# EAGLE design source_eagle (EAGLE 9.6.2)
COMPANY: ADAFRUIT INDUSTRIES; DRAWN: KTOWN; REV: B
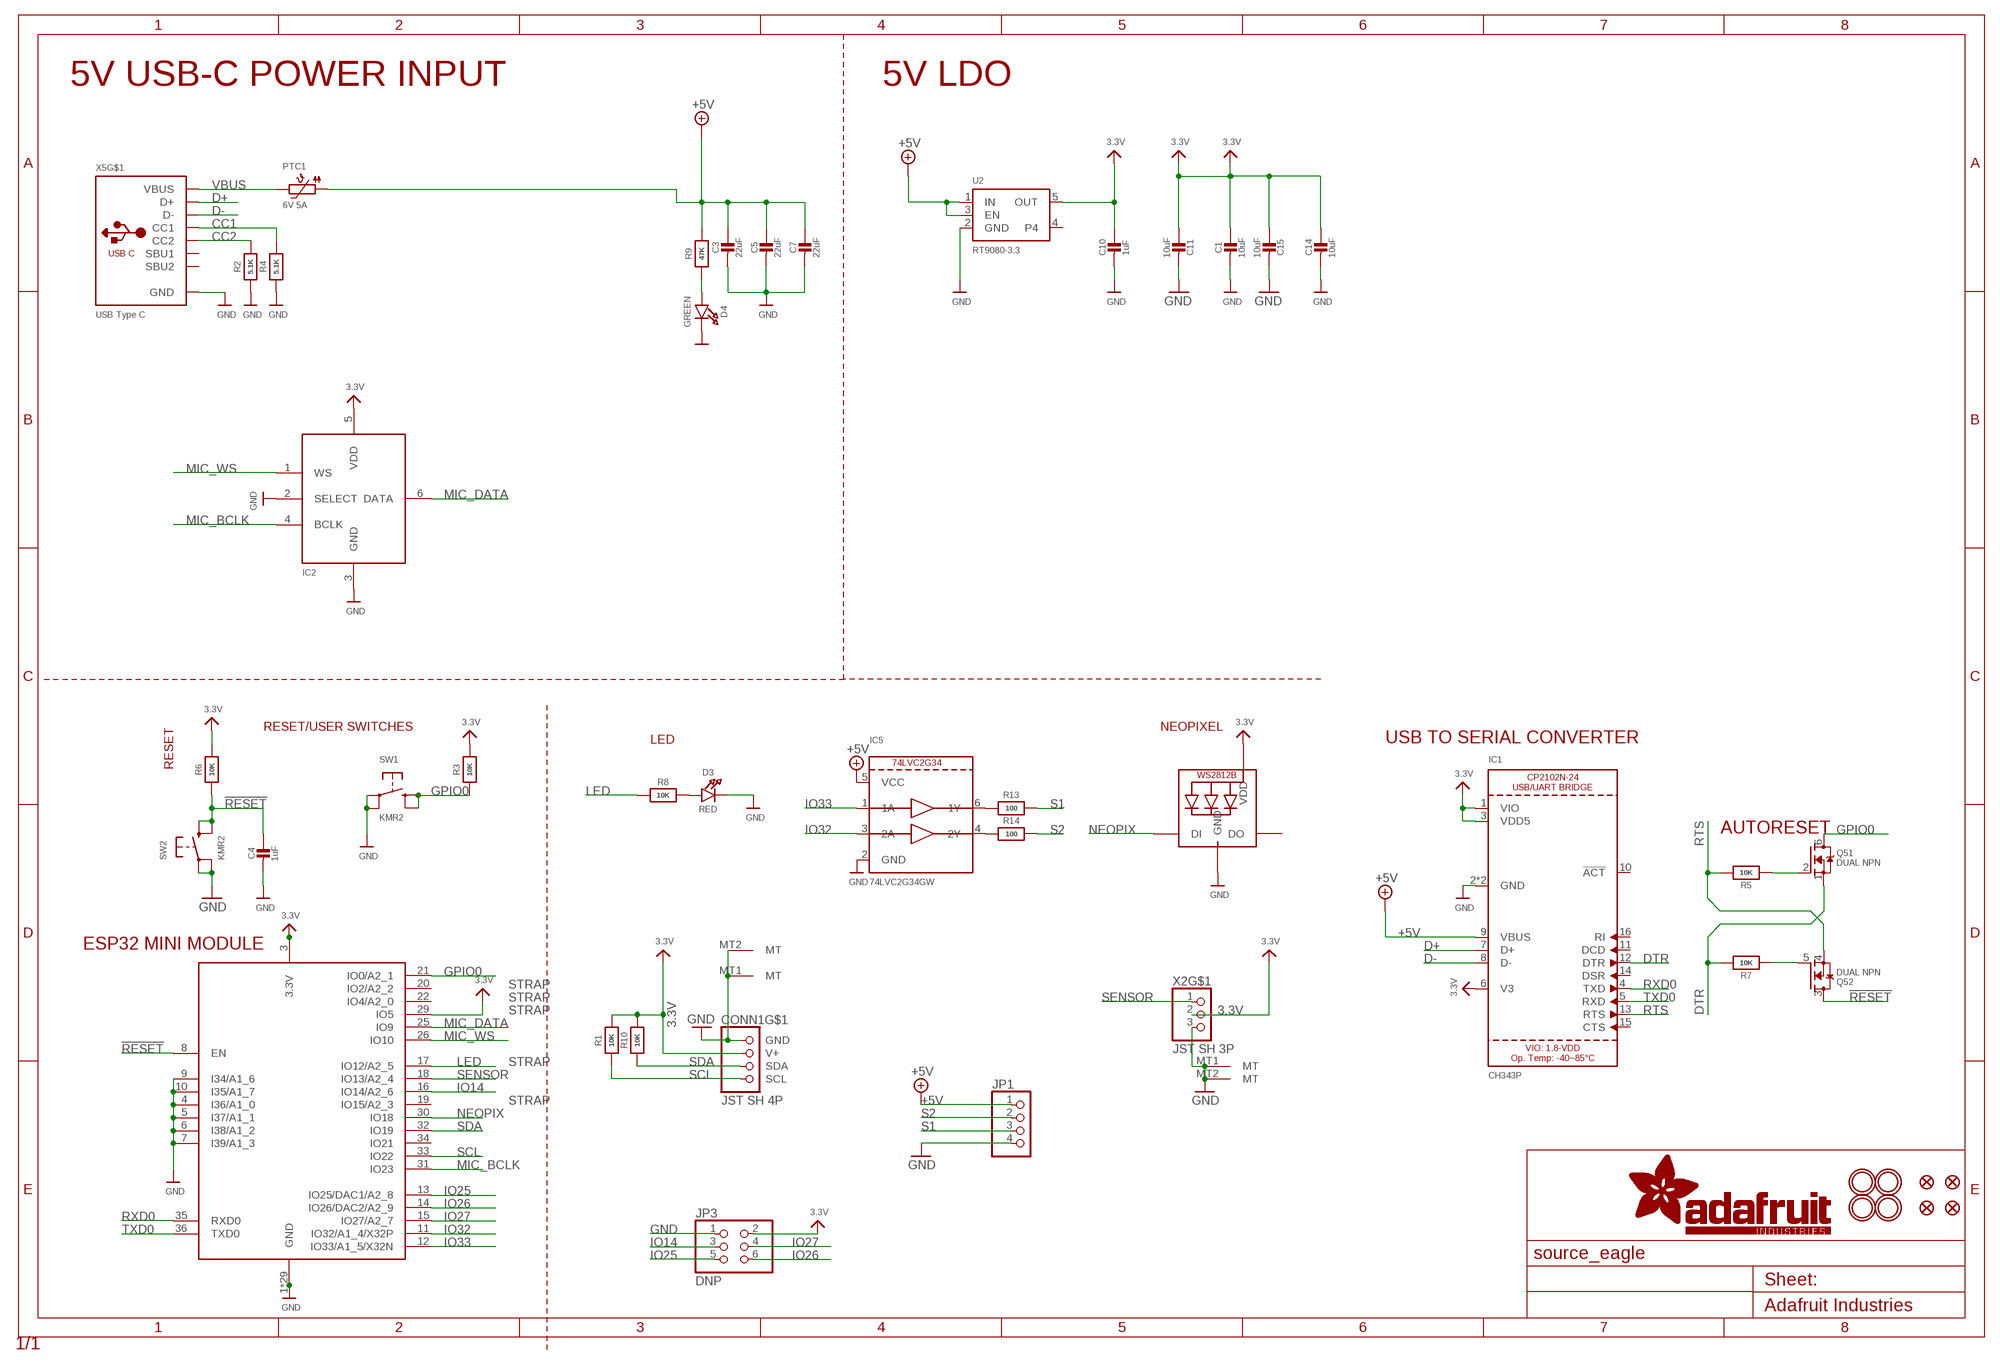
[diagram p0: schematic, sheet 1]

## Parts
C1  10uF  CAP_CERAMIC0805-NOOUTLINE  [0805-NO]
C3  22uF  CAP_CERAMIC0805-NOOUTLINE  [0805-NO]
C4  1uF  CAP_CERAMIC_0402NO  [_0402NO]
C5  22uF  CAP_CERAMIC0805-NOOUTLINE  [0805-NO]
C7  22uF  CAP_CERAMIC0805-NOOUTLINE  [0805-NO]
C10  1uF  CAP_CERAMIC_0402NO  [_0402NO]
C11  10uF  CAP_CERAMIC0805-NOOUTLINE  [0805-NO]
C14  10uF  CAP_CERAMIC0805-NOOUTLINE  [0805-NO]
C15  10uF  CAP_CERAMIC0805-NOOUTLINE  [0805-NO]
CONN1  JST SH 4P  STEMMA_I2C_QT  [JST_SH4]
D3  RED  LED0603_NOOUTLINE  [CHIPLED_0603_NOOUTLINE]
D4  GREEN  LED0603_NOOUTLINE  [CHIPLED_0603_NOOUTLINE]
IC1  CH343P  [QFN16_3MM]
IC2  ICS-43434  MIC_I2S_SPH0645  [SPH0645LM4H]
IC5  74LVC2G34GW  [SC70-6L]
JP1  HEADER-1X4  [1X04_OVAL]
JP3  DNP  HEADER-2X3  [2X03_ROUND_70MIL]
LED1  WS2812B_SK6805_1515  [SK6805_1515]
PTC1  6V 5A  PTC1210  [PTC1210]
Q5  DUAL NPN  MOSFET-N_DUAL  [SOT363]
R1  10K  RESISTOR_0402NO  [_0402NO]
R2  5.1K  RESISTOR_0402NO  [_0402NO]
R3  10K  RESISTOR_0402NO  [_0402NO]
R4  5.1K  RESISTOR_0402NO  [_0402NO]
R5  10K  RESISTOR_0402NO  [_0402NO]
R6  10K  RESISTOR_0402NO  [_0402NO]
R7  10K  RESISTOR_0402NO  [_0402NO]
R8  10K  RESISTOR_0402NO  [_0402NO]
R9  47K  RESISTOR_0402NO  [_0402NO]
R10  10K  RESISTOR_0402NO  [_0402NO]
R13  100  RESISTOR_0402NO  [_0402NO]
R14  100  RESISTOR_0402NO  [_0402NO]
SW1  KMR2  SWITCH_TACT_SMT_RKB2  [BTN_RKB2_4.6X2.8]
SW2  KMR2  SWITCH_TACT_SMT_RKB2  [BTN_RKB2_4.6X2.8]
U2  RT9080-3.3  VREG_SOT23-5  [SOT23-5]
U$14  MOUNTINGHOLE2.5  [MOUNTINGHOLE_2.5_PLATED]
U$20  MOUNTINGHOLE2.5  [MOUNTINGHOLE_2.5_PLATED]
U$23  FIDUCIAL_0.5MM  [FIDUCIAL_0.5MM]
U$25  FIDUCIAL_0.5MM  [FIDUCIAL_0.5MM]
U$28  MOUNTINGHOLE2.5  [MOUNTINGHOLE_2.5_PLATED]
U$31  MOUNTINGHOLE2.5  [MOUNTINGHOLE_2.5_PLATED]
U$34  FIDUCIAL_0.5MM  [FIDUCIAL_0.5MM]
U$35  FIDUCIAL_0.5MM  [FIDUCIAL_0.5MM]
X2  JST SH 3P  CON_JST_SH_3PINHORZ  [JST_SH3]
X4  ESP32-MINI-1  [ESP32-MINI-1]
X5  USB Type C  USB_C  [USB_C_CUSB31-CFM2AX-01-X]

## Nets
3.3V: C1.1 C10.1 C11.1 C14.1 C15.1 CONN1.2(V+) IC1.1(VIO) IC1.3(VDD5) IC1.6(V3) IC2.5(VDD) JP3.2 LED1.2(VDD) R1.2 R3.2 R6.2 R10.2 U2.5(OUT) X2.2 X4.3(3.3V) X4.29(IO5)
!RESET: C4.1 Q5.3(2:D) R6.1 SW2.B'(S1) SW2.B(S) X4.8(EN)
+5V: C3.1 C5.1 C7.1 IC1.9(VBUS) IC5.5(VCC) JP1.1 PTC1.P$1 R9.2 U2.1(IN) U2.3(EN)
CC1: R4.2 X5.A5(CC1)
CC2: R2.2 X5.B5(CC2)
D+: IC1.7(D+) X5.A6(D+) X5.B6(D+)
D-: IC1.8(D-) X5.A7(D-) X5.B7(D-)
DTR: IC1.12(DTR) Q5.1(1:S) R7.2
GND: C1.2 C3.2 C4.2 C5.2 C7.2 C10.2 C11.2 C14.2 C15.2 CONN1.1(GND) CONN1.MT1(MT) CONN1.MT2(MT) D3.C D4.C IC1.2(GND) IC1.THERMAL(GND) IC2.2(SELECT) IC2.3(GND) IC5.2(GND) JP1.4 JP3.1 LED1.4(GND) R2.1 R4.1 SW1.A'(P1) SW1.A(P) SW2.A'(P1) SW2.A(P) U2.2(GND) X2.3 X2.MT1(MT) X2.MT2(MT) X4.1(GND) X4.2(GND) X4.4(I36/A1_0) X4.5(I37/A1_1) X4.6(I38/A1_2) X4.7(I39/A1_3) X4.9(I34/A1_6) X4.10(I35/A1_7) X4.27(GND) X4.38(GND) X4.39(GND) X4.40(GND) X4.41(GND) X4.42(GND) X4.43(GND) X4.44(GND) X4.45(GND) X4.46(GND) X4.47(GND) X4.48(GND) X4.49(GND) X4.50(GND) X4.51(GND) X4.52(GND) X4.53(GND) X4.54(GND) X4.55(GND) X4.56(GND) X4.57(GND) X4.58(GND) X4.59(GND) X4.60(GND) X4.61(GND) X4.62(GND) X4.63(GND) X5.A1B12(GND) X5.B1A12(GND)
GPIO0: Q5.6(1:D) R3.1 SW1.B'(S1) SW1.B(S) X4.21(IO0/A2_1)
IO14: JP3.3 X4.16(IO14/A2_6)
IO25: JP3.5 X4.13(IO25/DAC1/A2_8)
IO26: JP3.6 X4.14(IO26/DAC2/A2_9)
IO27: JP3.4 X4.15(IO27/A2_7)
IO32: IC5.3(2A) X4.11(IO32/A1_4/X32P)
IO33: IC5.1(1A) X4.12(IO33/A1_5/X32N)
LED: R8.1 X4.17(IO12/A2_5)
MIC_BCLK: IC2.4(BCLK) X4.31(IO23)
MIC_DATA: IC2.6(DATA) X4.25(IO9)
MIC_WS: IC2.1(WS) X4.26(IO10)
N$1: D3.A R8.2
N$7: Q5.5(2:G) R7.1
N$8: Q5.2(1:G) R5.1
N$10: IC5.6(1Y) R13.1
N$11: IC5.4(2Y) R14.1
N$15: D4.A R9.1
NEOPIX: LED1.1(DI) X4.30(IO18)
RTS: IC1.13(RTS) Q5.4(2:S) R5.2
RXD0: IC1.4(TXD) X4.35(RXD0)
S1: JP1.3 R13.2
S2: JP1.2 R14.2
SCL: CONN1.4(SCL) R1.1 X4.33(IO22)
SDA: CONN1.3(SDA) R10.1 X4.32(IO19)
SENSOR: X2.1 X4.18(IO13/A2_4)
TXD0: IC1.5(RXD) X4.36(TXD0)
VBUS: PTC1.P$2 X5.A4B9(VBUS) X5.B4A9(VBUS)
Unconnected: IC1.10(!ACT) IC1.11(DCD) IC1.14(DSR) IC1.15(CTS) IC1.16(RI) LED1.3(DO) U2.4 X4.19(IO15/A2_3) X4.20(IO2/A2_2) X4.22(IO4/A2_0) X4.34(IO21) X5.A8(SBU1) X5.B8(SBU2) X5.M1(MT) X5.M2(MT) X5.M3(MT) X5.M4(MT)

## Notes on the sheet
- 5V USB-C POWER INPUT | 5V LDO
- RESET/USER SWITCHES | NEOPIXEL
- LED | USB TO SERIAL CONVERTER
- RESET
- AUTORESET
- ESP32 MINI MODULE
- STRAP
- STRAP
- STRAP
- STRAP
- STRAP

## Library data of the parts
C1 C3-C5 C7 C10 C11 C14 C15 = microbuilder:CAP_CERAMIC: Ceramic Capacitors For new designs, use the packages preceded by an '_' character since they are more reliable: The following footprints should be used on most boards: _0402 - Standard footprint for regular board layouts _0603 - Standard footprint for regular board layouts _0805 - Standard footprint for regular board layouts _1206 - Standard footprint for regular board layouts For extremely tight-pitch boards where space is at a premium, the following 'micro-pitch' footprints can be used (smaller pads, no silkscreen outline, etc.): _0402MP - Micro-pitch footprint for very dense/compact boards _0603MP - Micro-pitch footprint for very dense/compact boards _0805MP - Micro-pitch footprint for very dense/compact boards _1206MP - Micro-pitch footprint for very dense/compact boards
CONN1 = adafruit_electromech:STEMMA_I2C; LCSC: C2845363
D3 D4 = microbuilder:LED: LED 0603 - 0603 Surface Mount Package 2mA: Green LED - Low Power (3.9mcd, 2ma, 1.7Vf) - Digikey: 475-2709-2-ND Orange LED - Low Power (9.8mcd, 2ma, 1.8Vf) - Digikey: 475-1194-2-ND Red LED - Low Power (5mcd, 2ma, 1.8Vf) - Digikey: 475-1195-2-ND Yellow LED - Low Power (7mcd, 2ma, 1.8Vf) - Digikey: 475-1196-2-ND 5mA: Blue LED - Low Power (17mcd, 5ma, 2.9Vf) - Digikey: LNJ937W8CRACT-ND 0805 - 0805 Surface Mount Package 2mA: Red LED (8.8mcd, 2mA, 1.8Vf, Clear) - Low Power [Digikey: 475-2510-1-ND] Green LED (5mcd, 2mA, 1.8Vf, Clear) - Low Power [Digikey: 475-2730-1-ND] Yellow LED (11.3mcd, 2mA, 1.8Vf, Clear) - Low Power [Digikey: 475-2555-1-ND] 20mA: Red LED (104mcd, 20mA, Diffused) - LS R976 [Digikey: 475-1278-6-ND] Red LED (12mcd, 20mA, 2.0Vf, Clear) - APT2012EC [Digikey: 754-1128-1-ND] Green LED (15mcd, 20mA, 2.2Vf, Clear) - APT2012GC [Digikey: 754-1131-1-ND] Orange LED (160mcd, 20mA, 2.1Vf, Clear) - APT2012SECK [Digikey: 754-1130-1-ND] 1206 - 1206 Surface Mount Package Green LED (26mcd, 20mA, Diffused) - LG N971 [Digikey: 475-1407-6-ND] Red LED (15mcd, 20mA, Diffused) - LH N974 [Digikey: 475-1416-6-ND] Cree - Cree High-Power Surface Mount LEDs XPEBWT-L1-0000-00D50 - White 111lm 350mA 2.9Vf 6200K 110° XTEAWT-00-0000-00000LEE3 - White 114lm 350mA 2.85Vf 5000K 115° Everlight - Everlight 45-21 Series Surface Mount LEDs 45-21/QK2C-B2832AC2CB2/2T - Warm White 2000mcd 20mA 3.25Vf 3050K 120° 45-21/LK2C-B38452C4CB2/2T - Nuetral White 2000mcd 20mA 3.25Vf 4150K 120° 45-21/LK2C-B50634C6CB2/2T - Cold White 2200mcd 20mA 3.25Vf 5650K 120° PLCC2 Reverse Mount LS T77K-J1L2-1-0-2-R18-Z - Red 11.25mcd 2mA 1.8Vf 630nm 120° LO T77K-L1M2-24-Z - Orange 19.6mcd 2mA 1.8Vf 606nm 120° LY T77K-K2M1-26-Z - Yellow 15.7mcd 2mA 1.8Vf 587nm 120°; ROT: 270
IC1 = microbuilder:CH343P
IC2 = microbuilder:MIC_I2S
IC5 = microbuilder:74LVC2G34
JP1 = microbuilder:HEADER-1X4: PIN HEADER
JP3 = microbuilder:HEADER-2X3: PIN HEADER
LED1 = microbuilder:WS2812B; LCSC: C2890035
PTC1 = microbuilder:PTC: PTC (Resettable Fuse) 1206 Package 250mA PTC (16V Max, Time-to-Trip: 0.08s) - Digikey: F2110CT-ND 1210 Package 100mA PTC (30V Max, Time-to-Trip: 0.6s) - Digikey: MF-USMF010-2CT-ND 1812 Package 750mA PTC (24V Max, Time-to-Trip: 0.2s) - Digikey: MF-MSMF075/24-2CT-ND
Q5 = microbuilder:MOSFET-N_DUAL: Dual N-Channel MOSFET SOT363 (2.0x1.25mm) 2N7002PS - 60V, 320mA [Digikey: 568-5984-1-ND]; JLC_ROTATION: 90
R1-R10 R13 R14 = microbuilder:RESISTOR: Resistors For new designs, use the packages preceded by an '_' character since they are more reliable: The following footprints should be used on most boards: _0402 - Standard footprint for regular board layouts _0603 - Standard footprint for regular board layouts _0805 - Standard footprint for regular board layouts _1206 - Standard footprint for regular board layouts For extremely tight-pitch boards where space is at a premium, the following 'micro-pitch' footprints can be used (smaller pads, no silkscreen outline, etc.): _0402MP - Micro-pitch footprint for very dense/compact boards _0603MP - Micro-pitch footprint for very dense/compact boards _0805MP - Micro-pitch footprint for very dense/compact boards _1206MP - Micro-pitch footprint for very dense/compact boards
SW1 SW2 = adafruit_electromech:SWITCH_TACT_SMT: SMT Tact Switches RKB2 https://www.digikey.com/short/m027prz5
U2 = adafruit_power:VREG_SOT23-5: SOT23-5 Fixed Voltage Regulators Part Current Out V Out V In V Dropout θJA (°C/W) TJ (°C) Digikey Part No. ADP121 150mA 3.3V 3.4-5.5V 0.09V @ 150mA -- -- ADP121-AUJZ33R7CT-ND ADP121 150mA 3.0V 3.1-5.5V 0.09V @ 150mA -- -- ADP121-AUJZ30R7CT-ND ADP122 300mA 3.3V 3.4-5.5V 0.085V @ 300mA -- -- ADP122AUJZ-3.3-R7CT-ND ADP1712 300mA 3.3V 3.5-5.5V 0.17V @ 300mA -- -- ADP1712AUJZ-3.3-R7TR-ND AP7311 (Low Cost) 150mA 3.3V 3.5-6V 0.15V @ 150mA -- -- AP7311-33WG-7DICT-ND LD39015M18R 150mA 1.8V 1.9V-5.5V 0.08V @ 100mA -- -- 497-6977-1-ND LP2985A-33DBVR 150mA 3.3V 3.3-16V 0.28V @ 150mA 206 150 296-18479-1-ND MCP1824T-3302E/OT 300mA 3.3V 3.5V-6V 0.2V @ 300mA -- -- MCP1824T-3302E/OTCT-ND MIC5205-2.5YM5 TR 150mA 2.5V 2.7-16V 0.165V @ 150mA -- -- 576-1257-2-ND MIC5205-3.0YM5 TR 150mA 3.0V 3.2V-16V 0.165V @ 150mA -- -- 576-1258-2-ND MIC5205-3.3YM5 TR 150mA 3.3V 3.5V-16V 0.165V @ 150mA -- -- 576-1259-2-ND TPS780330220 150mA 3.3V+2.2V 3.6-5.5V 250mV Max -- -- 296-23332-1-ND TDA3663/N1,135 100mA 3.3V 3.5-45V 0.18V @ 50mA -- -- 568-5343-1-ND Max operating temp can be calculated using θJA, TJ (max junction temperature), and power in watts. Set the "Maximum Ambient Temperature" until it reaches TJ ("Max Junction Temperature"), which is the absolute limit for safe use of the regulator: Heat Sink Temperature Calculator <http://www.daycounter.com/Calculators/Heat-Sink-Temperature-Calculator.phtml> For example, With 12V source into a 3.3V LP2985 and a 30mA load, we are dissipating (12V-3.3V) * 0.03A = 0.261W. With a θJA of 206 °C/W, a TJ of 150°C, and 261mW we can safely use the chip without a heat sink up to 75°C (=147.1°C Junction Temperature).; JLC_ROTATION: 0
U$14 U$20 U$28 U$31 = adafruit_electromech:MOUNTINGHOLE: Mounting Hole For #2 screws (0.086"/2.18mm width, 0.094"/2.4mm hole) use 2.5mm; BOM: EXCLUDE
U$23 U$25 U$34 U$35 = microbuilder:FIDUCIAL: Fiducial Alignment Points Various fiducial points for machine vision alignment.
X2 = adafruit_electromech:CON_JST_SH_3PIN
X4 = adafruit_wireless:ESP32-MINI-1
X5 = adafruit_electromech:USB_C: USB Type-C USB 2.0 Connector; LCSC: C165948

## Net classes
1 power: width 0.305 mm

## Board
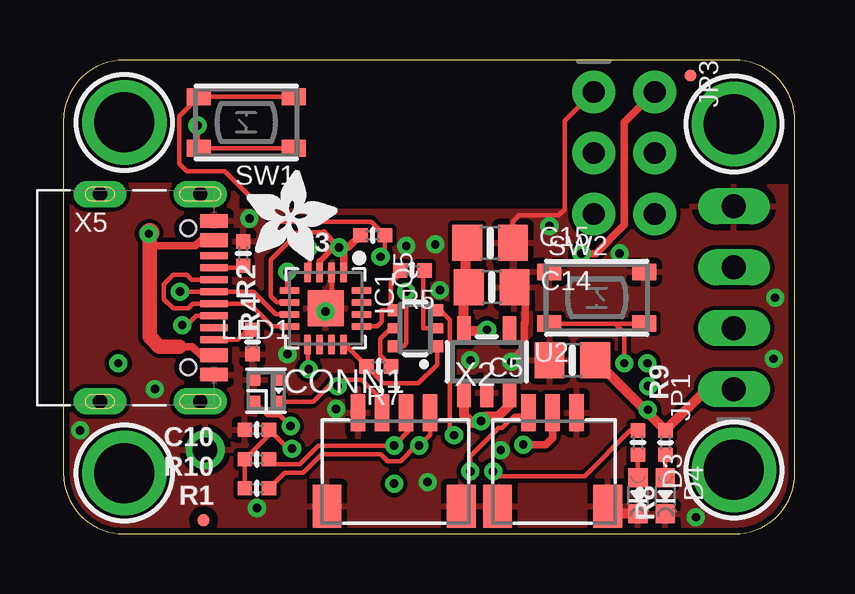
[diagram p1: board, top side]
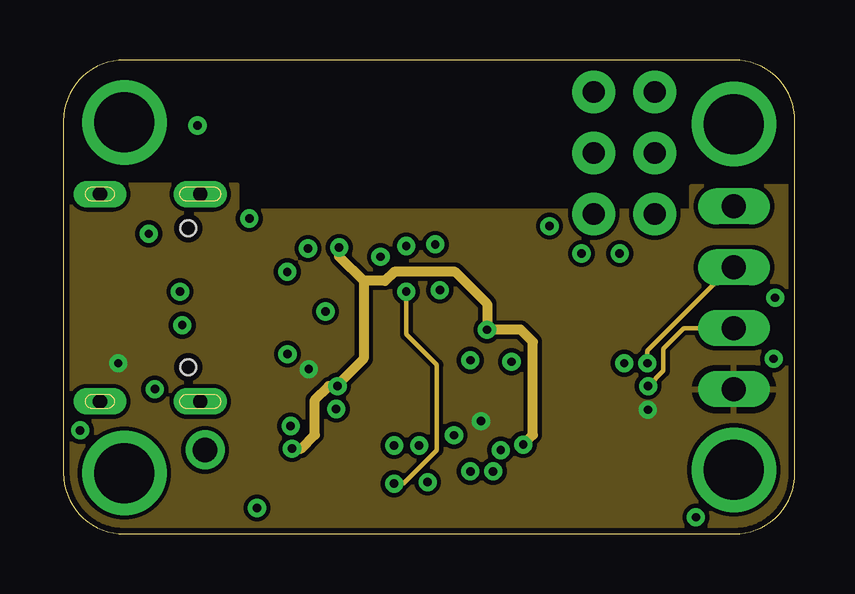
[diagram p2: board, inner layer Route2]
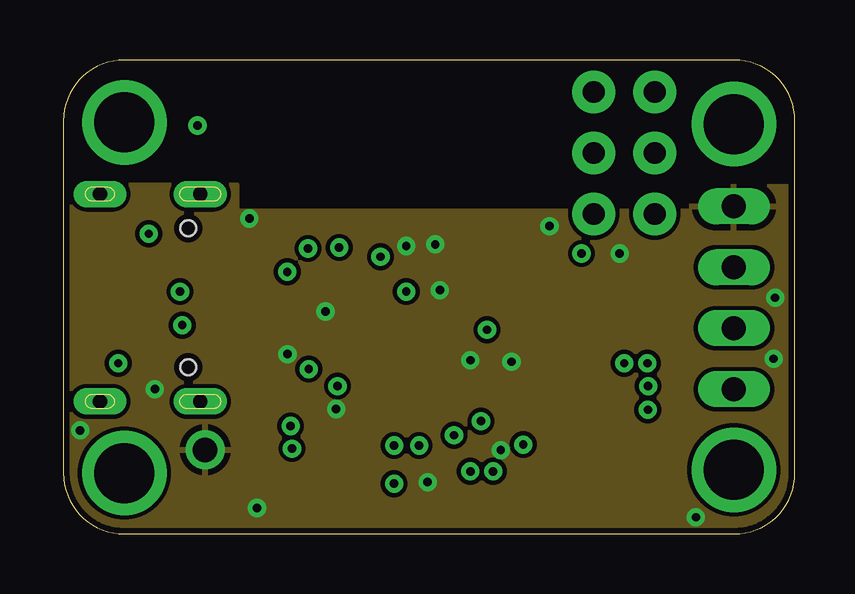
[diagram p3: board, inner layer Route15]
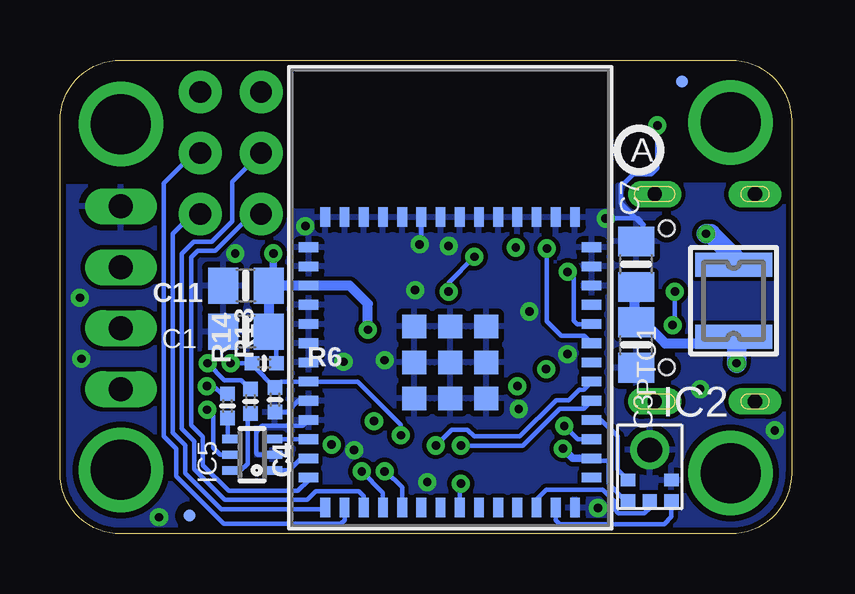
[diagram p4: board, bottom side, seen from below]

Size 30.48 x 19.75 mm. Coordinates in mm from the lower left corner, seen from the top.
Outline: 0,17.21 0,2.54 arc90 2.54,0 27.94,0 arc90 30.48,2.54 30.48,17.21 arc90 27.94,19.75 2.54,19.75 arc90 0,17.21
Copper layers (1+2*15+16): Top 0.035mm / dielectric 0.2mm / Route2 0.035mm / dielectric 1.45mm / Route15 0.035mm / dielectric 0.2mm / Bottom 0.035mm
Design rules "adafruit_4layer_dense *": minimum track width 7mil, minimum drill 13mil, track to track 7mil, track to pad 7mil, pad to pad 7mil, via to via 7mil, smd to smd 7mil, copper to edge 10mil, drill to drill 8mil, minimum pad ring 10mil, minimum via ring 8mil, stop-mask expansion 2mil, vias tented up to drill 20mil, thermal gap 10mil

### Footprints (pad centres in the part's own frame; a part is rotated, then mirrored left to right if it is on the bottom)
0805-NO = smd 1.24 x 1.5: 1 -0.95,0; 2 0.95,0
_0402NO = smd 0.6 x 0.6: 1 -0.508,0; 2 0.508,0
JST_SH4 = smd 0.6 x 1.55: 1 -1.5,2.006; 2 -0.5,2.006; 3 0.5,2.006; 4 1.5,2.006 | smd 1.2 x 1.8: MT1 -2.8,-1.894; MT2 2.8,-1.894
CHIPLED_0603_NOOUTLINE = smd 0.8 x 0.8: A 0,-0.75; C 0,0.75
QFN16_3MM = smd 0.8 x 0.28: 1 -1.5,0.75; 2 -1.5,0.25; 3 -1.5,-0.25; 4 -1.5,-0.75; 9 1.5,-0.75; 10 1.5,-0.25; 11 1.5,0.25; 12 1.5,0.75 | smd 0.28 x 0.8: 5 -0.75,-1.5; 6 -0.25,-1.5; 7 0.25,-1.5; 8 0.75,-1.5; 13 0.75,1.5; 14 0.25,1.5; 15 -0.25,1.5; 16 -0.75,1.5 | smd 1.5 x 1.5: THERMAL 0,0
SPH0645LM4H = smd 0.6 x 0.525: 1 -0.9,1.4; 2 -0.9,0.55; 4 0.9,0.55; 5 0.9,1.4; 6 0,1.4 | drill 1.025 pad 1.625: 3 0,-0.71
SC70-6L = smd 0.35 x 0.8: 1 -0.65,-0.85; 2 0,-0.85; 3 0.65,-0.85; 4 0.65,0.85; 5 0,0.85; 6 -0.65,0.85
1X04_OVAL = drill 1 long: 1 -3.81,0; 2 -1.27,0; 3 1.27,0; 4 3.81,0
2X03_ROUND_70MIL = drill 0.9 pad 1.778: 1 -2.54,-1.27; 2 -2.54,1.27; 3 0,-1.27; 4 0,1.27; 5 2.54,-1.27; 6 2.54,1.27
SK6805_1515 = smd 0.5 x 0.5: 1 -0.5,-0.45; 2 0.5,-0.45; 3 0.5,0.45; 4 -0.5,0.45
PTC1210 = smd 1 x 3.2: P$1 -1.5,0; P$2 1.5,0
SOT363 = smd 0.5 x 0.5: 1 -0.75,-0.9; 3 0.75,-0.9; 4 0.75,0.9; 6 -0.75,0.9 | smd 0.4 x 0.5: 2 0,-0.9; 5 0,0.9
BTN_RKB2_4.6X2.8 = smd 1 x 0.7: A 1.973,1.075; A' -1.973,1.075; B 1.973,-1.075; B' -1.973,-1.075
SOT23-5 = smd 0.55 x 1.2: 1 -0.95,-1.3; 2 0,-1.3; 3 0.95,-1.3; 4 0.95,1.3; 5 -0.95,1.3
MOUNTINGHOLE_2.5_PLATED = drill 2.5 pad 3.2: P$1 0,0
FIDUCIAL_0.5MM = smd 0.5 x 0.5: 1 0,0
JST_SH3 = smd 0.6 x 1.55: 1 -1,2.006; 2 0,2.006; 3 1,2.006 | smd 1.2 x 1.8: MT1 -2.3,-1.894; MT2 2.3,-1.894
ESP32-MINI-1 = smd 0.813 x 0.406: 1 -5.9,4.9; 2 -5.9,4.1; 3 -5.9,3.3; 4 -5.9,2.5; 5 -5.9,1.7; 6 -5.9,0.9; 7 -5.9,0.1; 8 -5.9,-0.7; 9 -5.9,-1.5; 10 -5.9,-2.3; 11 -5.9,-3.1; 12 -5.9,-3.9; 13 -5.9,-4.7; 28 5.9,-4.7; 29 5.9,-3.9; 30 5.9,-3.1; 31 5.9,-2.3; 32 5.9,-1.5; 33 5.9,-0.7; 34 5.9,0.1; 35 5.9,0.9; 36 5.9,1.7; 37 5.9,2.5; 38 5.9,3.3; 39 5.9,4.1; 40 5.9,4.9 | smd 0.406 x 0.813: 14 -5.2,-5.95; 15 -4.4,-5.95; 16 -3.6,-5.95; 17 -2.8,-5.95; 18 -2,-5.95; 19 -1.2,-5.95; 20 -0.4,-5.95; 21 0.4,-5.95; 22 1.2,-5.95; 23 2,-5.95; 24 2.8,-5.95; 25 3.6,-5.95; 26 4.4,-5.95; 27 5.2,-5.95; 41 5.2,6.15; 42 4.4,6.15; 43 3.6,6.15; 44 2.8,6.15; 45 2,6.15; 46 1.2,6.15; 47 0.4,6.15; 48 -0.4,6.15; 49 -1.2,6.15; 50 -2,6.15; 51 -2.8,6.15; 52 -3.6,6.15; 53 -4.4,6.15; 54 -5.2,6.15 | smd 0.991 x 0.991: 55 -1.5,1.6; 56 0,1.6; 57 1.5,1.6; 58 -1.5,0.1; 59 0,0.1; 60 1.5,0.1; 61 -1.5,-1.4; 62 0,-1.4; 63 1.5,-1.4
USB_C_CUSB31-CFM2AX-01-X = smd 0.575 x 1.15: A1B12 -3.2,2.275; A4B9 -2.4,2.275; B1A12 3.2,2.275; B4A9 2.4,2.275 | smd 0.275 x 1.15: A5 -1.25,2.275; A6 -0.25,2.275; A7 0.25,2.275; A8 1.25,2.275; B5 1.75,2.275; B6 0.75,2.275; B7 -0.75,2.275; B8 -1.75,2.275 | drill 0.6 pad 1 long: M1 -4.32,1.7; M2 4.32,1.7; M3 -4.32,-2.48; M4 4.32,-2.48 | hole 0.65: 2.89,1.2; -2.89,1.2

### Placement (x,y rotation side)
C1  22.73,8.43 180 bottom
C3  6.48,7.87 270 bottom
C4  21.53,5.59 270 bottom
C5  21.21,7.24 180 top
C7  6.48,11.24 90 bottom
C10  8.06,4.34 180 top
C11  22.73,10.35 180 bottom
C14  17.84,10.29 0 top
C15  17.78,12.13 0 top
CONN1  13.78,3.05 0 top
D3  23.94,1.59 180 top
D4  25.08,1.59 180 top
IC1  10.92,9.4 270 top
IC2  5.91,2.79 180 bottom
IC5  22.48,3.3 90 bottom
JP1  27.94,9.84 90 top
JP3  23.37,15.88 270 top
LED1  8.45,5.97 0 top
PLABEL0  [PLABEL0]  6.86,14.41 0 top
PLABEL1  [PLABEL1]  20.38,11.56 0 top
PLABEL2  [PLABEL2]  10.16,0.32 90 top
PLABEL3  [PLABEL3]  22.99,4.7 90 top
PLABEL4  [PLABEL4]  9.27,5.84 0 top
PLABEL5  [PLABEL5]  25.65,6.1 90 top
PLABEL6  [PLABEL6]  24.32,4.57 90 top
PLABEL7  [PLABEL7]  4.7,1.46 0 top
PLABEL8  [PLABEL8]  26.29,13.91 90 top
PLABEL9  [PLABEL9]  26.23,10.16 90 top
PLABEL10  [PLABEL10]  26.23,7.68 90 top
PLABEL11  [PLABEL11]  15.43,17.02 0 top
PLABEL15  [PLABEL15]  23.3,17.08 0 bottom
PLABEL16  [PLABEL16]  26.16,19.18 0 bottom
PLABEL17  [PLABEL17]  23.37,19.18 0 bottom
PLABEL18  [PLABEL18]  1.84,12.83 0 bottom
PLABEL20  [PLABEL20]  23.24,14.48 0 bottom
PLABEL21  [PLABEL21]  25.72,14.54 0 bottom
PLABEL22  [PLABEL22]  25.46,17.08 0 bottom
PLABEL23  [PLABEL23]  16.38,13.65 0 top
PTC1  2.41,9.72 90 bottom
Q5  14.67,8.57 90 top
R1  8.06,1.91 180 top
R2  7.87,8 90 top
R3  12.89,12.45 180 top
R4  7.49,11.68 270 top
R5  14.54,10.99 180 top
R6  21.97,7.11 0 bottom
R7  13.14,6.99 180 top
R8  23.94,3.81 270 top
R9  25.08,3.81 90 top
R10  8.06,3.11 180 top
R13  22.54,5.52 90 bottom
R14  23.5,5.33 90 bottom
SW1  7.62,17.14 180 top
SW2  22.23,9.84 0 top
U2  17.64,7.18 0 top
U$14  2.54,2.54 0 top
U$20  27.94,17.08 0 top
U$23  4.57,18.86 0 bottom
U$25  25.08,0.76 0 bottom
U$27  [ADAFRUIT_3.5MM]  7.62,11.37 0 top
U$28  2.54,17.14 0 top
U$29  [PCBFEAT-REV-040]  6.35,16 0 bottom
U$31  27.94,2.67 0 top
U$34  5.84,0.57 270 top
U$35  26.12,19.1 270 top
X2  20.38,3.05 0 top
X4  14.22,7.05 0 bottom
X5  4,9.84 270 top

### Tracks (layer width: path | path; a pad name or v marks a point on that pad's centre or on a via)
3.3V  (via drill 0.35)
  Top 0.178: IC1.6 8.89,9.65 8.64,9.91 8.64,11.43 9.78,12.57 10.86,12.57 | CONN1.2 13.28,5.58 12.44,6.42 11.68,6.42 v11.42,6.16 11.36,6.22 11.11,6.22 10.41,5.52 LED1.2 | R1.2 R10.2 8.57,4.13 C10.1 9.36,3.56 v9.53,3.56
  Top 0.254: IC1.3 10.67,11.37 11.24,11.94 | 10.86,12.57 11.34,12.1 11.18,11.94 11.24,11.94 | v11.49,11.94 11.24,11.94
  Top 0.305: 16.76,12.13 C15.1 | R3.2 11.87,11.94 11.75,11.94 | 11.75,11.94 v11.49,11.94 | IC1.1 11.67,11.86 11.75,11.94 | JP3.2 23.37,17.14 23.37,12.88 22.18,11.68 v21.59,11.68 | X2.2 20.38,4 20.11,3.72 v19.16,3.72
  Top 0.406: 16.76,12.13 16.76,10.42 C14.1 16.69,10.08 U2.5 17.62,8.48 v17.65,8.51
  Route2 0.178: 11.37,6.16 v11.42,6.16
  Route2 0.406: v19.16,3.72 19.16,3.73 19.56,4.13 19.56,8 19.05,8.51 v17.65,8.51 17.65,9.59 16.32,10.92 13.78,10.92 13.4,10.54 12.51,10.54 | 12.51,10.54 11.49,11.56 v11.49,11.94 | 12.51,10.54 12.51,7.3 11.37,6.16 11.05,6.16 10.48,5.59 10.48,4.13 9.91,3.56 v9.53,3.56
  Bottom 0.178: C1.1 21.46,8.11 R6.2 | IC2.5 6.92,1.39 7.62,2.1 7.62,3.05 8.16,3.05 8.26,3.15 X4.29
  Bottom 0.305: v21.59,11.68 21.59,10.54 C11.1 | v9.53,3.56 9.12,3.15 X4.29
  Bottom 0.406: v17.65,8.51 17.65,9.59 18.41,10.35 X4.3 C11.1 C1.1
!RESET  (via drill 0.35)
  Top 0.178: Q5.3 15.71,9.32 16.1,8.93 16.1,4.29 v16.28,4.11 | SW2.B' 22.99,8.77 | 22.99,8.77 SW2.B | 22.99,8.77 23.37,8.39 v23.37,7.11
  Bottom 0.178: v16.28,4.11 16.28,4.56 18.07,6.35 X4.8 21.27,6.35 C4.1 22.42,6.99 22.42,7.11 R6.1 v23.37,7.11
+5V  (via drill 0.35)
  Top 0.178: IC1.9 10.17,6.92 v10.22,6.87 | 26.8,6.03 JP1.1 | 24.35,5.05 v24.35,5.17 24.22,5.17
  Top 0.406: U2.1 16.69,4.96 17.02,4.64 17.4,4.64 v17.4,4.7 17.59,4.89 18.1,4.89 18.59,5.38 U2.3 | 26.8,6.03 R9.2 24.35,5.05 | 24.22,5.17 C5.1
  Bottom 0.178: IC5.5 23.81,3.3 24.1,3.59 24.1,4.92 v24.35,5.17 | C3.1 6.48,9.78 6.54,9.84
  Bottom 0.406: PTC1.P$1 2.69,7.94 5.27,7.94 6.54,9.21 6.54,9.84 | 6.48,9.78 C7.1
  Bottom 0.813: PTC1.P$1 2.29,8.09 2.32,8.05 2.29,7.78 v2.29,7.11
  pour Route2: 0,14.54 7.24,14.54 7.24,13.46 26.16,13.46 26.16,14.48 30.48,14.48 30.48,0 0,0
CC1
  Top 0.178: X5.A5 7.32,11.09 R4.2
CC2
  Top 0.178: X5.B5 7.27,8.09 7.68,8.51 R2.2
D+  (via drill 0.35)
  Top 0.178: IC1.7 8.85,9.15 7.91,10.09 X5.A6 v4.87,10.09 v4.86,10.1 | v4.95,8.7 5.14,8.7 5.54,9.09 X5.B6
  Bottom 0.178: v4.86,10.1 4.86,8.79 v4.95,8.7
D-
  Top 0.178: IC1.8 8.71,8.65 7.77,9.59 X5.A7 5.39,9.59 5.2,9.4 4.57,9.4 4.19,9.78 4.19,10.41 4.57,10.79 5.14,10.79 5.35,10.59 X5.B7
DTR
  Top 0.178: Q5.1 15.57,7.06 14.79,6.29 13.34,6.29 R7.2 11.72,7.9 IC1.12
GND  (via drill 0.35)
  Top 0.178: IC1.2 11.17,9.65 IC1.THERMAL | SW1.A' SW1.A 5.59,16.13 v5.59,17.02 | JP3.1 20.89,17.21 20.89,13.53 20.64,13.27 18.99,13.27 18.73,13.02 C15.2 | C5.2 20.26,6.73
  Top 0.305: v18.67,7.18 18.67,7.21 19.2,7.74 19.2,8.78 19.24,8.83 19.24,9.84 C14.2
  Top 0.406: D3.C 22.68,0.84 X2.MT2
  Bottom 0.178: v5.59,17.02 5.59,15.24 5.84,14.98 6.59,14.98 6.97,14.61 7.05,14.61 7.11,14.54 7.11,13.78 6.22,12.89 6.16,12.89 6.41,13.14 v7.75,13.14 | X4.49 15.42,12.13 v15.49,12.06 | IC5.2 22.24,3.3 22.31,3.37 22.31,4.25 22.05,4.51 20.36,4.51 X4.10 | C4.2 21.02,5.08 20.55,5.55 X4.9
  other vias: 16.95,7.24 15.18,2.16 23.18,11.68 29.65,9.84 29.59,7.3 26.35,0.7 8.06,1.08 3.81,6.03 0.7,4.32 11.37,5.21 10.92,9.27 9.33,7.49 20.26,12.83 18.22,3.49 14.29,12 15.68,10.16
  pour Bottom: 0,14.54 7.24,14.54 7.24,13.46 26.16,13.46 26.16,14.48 30.48,14.48 30.48,0 0,0
  pour Top: 0,14.54 7.24,14.54 7.24,13.46 26.16,13.46 26.16,14.48 30.48,14.48 30.48,0 0,0
  pour Route15: 0,14.54 7.24,14.54 7.24,13.46 26.16,13.46 26.16,14.48 30.48,14.48 30.48,0 0,0
GPIO0  (via drill 0.35)
  Top 0.178: Q5.6 14.17,7.82 14.29,7.94 v14.29,10.1 | SW1.B' SW1.B 4.83,17.4 4.83,15.43 5.14,15.11 6.73,15.11 8.83,13.02 12.83,13.02 R3.1 13.4,11.74 v13.21,11.55
  Route2 0.178: v13.78,2.1 14.16,2.1 15.56,3.49 15.56,7.05 14.29,8.32 v14.29,10.1
  Bottom 0.178: X4.21 13.82,2.05 v13.78,2.1 | v13.21,11.55 14.29,10.48 v14.29,10.1
IO14
  Bottom 0.178: X4.16 17.82,1.57 18.03,1.77 19.82,1.77 20.17,1.42 23.61,1.42 24.88,2.69 24.88,3.86 25.4,4.38 25.4,11.68 24.91,12.18 24.16,12.18 23.3,13.03 23.3,14.67 JP3.3
IO25
  Bottom 0.178: X4.13 20.12,2.25 20.57,1.8 23.45,1.8 24.52,2.87 24.52,4.04 25.02,4.54 25.02,11.53 24.75,11.8 24,11.8 22.46,13.34 JP3.5
IO26
  Bottom 0.178: X4.14 19.49,1.03 23.77,1.03 25.26,2.53 25.26,3.7 25.78,4.22 25.78,12.51 24.96,13.34 JP3.6
IO27
  Bottom 0.178: X4.15 18.62,0.58 18.78,0.42 23.66,0.42 25.64,2.41 25.64,3.55 26.16,4.06 26.16,14.61 24.89,15.88 JP3.4
IO32
  Bottom 0.178: X4.11 20.78,3.95 IC5.3
IO33
  Bottom 0.178: IC5.1 20.93,2.65 20.43,3.15 X4.12
LED  (via drill 0.35)
  Top 0.178: v17.91,2.61 18.1,2.41 21.72,2.41 23.62,4.32 R8.1
  Bottom 0.178: X4.17 17.02,1.73 v17.91,2.61
MIC_BCLK
  Bottom 0.178: IC2.4 7.24,2.68 7.24,4.06 7.92,4.75 X4.31
MIC_DATA
  Bottom 0.178: IC2.6 5.91,1.08 6.13,0.86 7.22,0.86 7.37,1.02 7.37,1.34 7.87,1.84 10.22,1.84 10.62,1.44 X4.25
MIC_WS
  Bottom 0.178: IC2.1 5,0.71 5.31,0.41 9.65,0.41 9.82,0.58 X4.26
N$1
  Top 0.178: D3.A R8.2
N$7
  Top 0.178: Q5.5 13.64,8.57 13.2,8.13 13.2,7.44 R7.1
N$8
  Top 0.178: Q5.2 14.99,8.57 14.99,10.92 R5.1
N$10
  Bottom 0.178: IC5.6 22.94,2.65 22.66,2.93 22.66,4.9 R13.1
N$11
  Bottom 0.178: R14.1 23.5,4.12 IC5.4
N$15
  Top 0.178: R9.1 D4.A
NEOPIX  (via drill 0.35)
  Top 0.178: LED1.1 8.51,4.95 9.02,4.95 v9.47,4.5
  Bottom 0.178: v9.47,4.5 8.91,3.95 X4.30
RTS
  Top 0.178: R5.2 14.03,10.86 13.64,10.47 13.64,9.45 Q5.4 13.26,9.32 13.26,8.84 13.07,8.65 IC1.13
RXD0  (via drill 0.35)
  Top 0.178: v10.19,11.9 10.27,11.82 10.27,10.99 IC1.4
  Bottom 0.178: X4.35 8.64,8.27 9.6,8.27 10.19,8.86 v10.19,11.9
S1  (via drill 0.35)
  Route2 0.178: v24.33,7.11 24.33,7.63 27.81,11.11 JP1.3
  Bottom 0.178: R13.2 22.92,6.41 23.63,6.41 v24.33,7.11
S2  (via drill 0.35)
  Route2 0.178: v24.36,6.16 25,6.79 25,7.72 25.84,8.57 JP1.2
  Bottom 0.178: R14.2 23.75,5.84 24,6.1 24.3,6.1 v24.36,6.16
SCL  (via drill 0.35)
  Top 0.178: CONN1.4 15.28,4.14 v14.82,3.68 14.69,3.68 14.05,3.04 13.51,3.04 13.22,3.33 10.78,3.33 10,2.56 9.22,2.56 R1.1
  Bottom 0.178: v14.82,3.68 14.15,4.35 13.5,4.35 13.22,4.06 11.32,4.06 9.81,5.57 9.29,5.57 8.84,6.02 8.65,6.02 X4.33
SDA  (via drill 0.35)
  Top 0.178: CONN1.3 14.48,4.86 14.48,4.38 v13.78,3.68 10.63,3.68 9.86,2.91 8.77,2.91 R10.1
  Bottom 0.178: X4.32 8.65,5.22 9.66,5.22 11.2,3.68 v13.78,3.68
SENSOR  (via drill 0.35)
  Top 0.178: X2.1 19.26,4.93 18.8,4.93 18.29,4.42 18.14,4.42 16.95,3.24 v16.95,2.61
  Bottom 0.178: X4.18 16.22,1.94 16.92,2.64 v16.95,2.61
TXD0  (via drill 0.35)
  Top 0.178: IC1.5 9.33,10.24 v9.33,10.92
  Bottom 0.178: v9.33,10.92 9.07,10.67 9.07,8.89 8.93,8.75 X4.36
VBUS  (via drill 0.35)
  Top 0.305: X5.A4B9 5.75,12.24 5.5,12 3.66,12 3.59,12.06 | X5.B4A9 5.75,7.44 5.38,7.81 4.83,7.81
  Top 0.61: 4.83,7.81 4,7.81 3.59,8.22 3.59,12.06 3.59,12.54
  Top 0.813: 3.59,12.54 v3.56,12.51
  Bottom 0.813: v3.56,12.51 3.37,12.51 2.41,11.56 PTC1.P$2

### Text on the board
Pinguin_tBackup: mini w/ESP32 | G | Reset | 33 | 32 | 5V | 13 | 12 | Neo | Mic | I2C
Pinguin_bBackup: G | 3V | 14 | 27 | 25 | 26 | Fuse